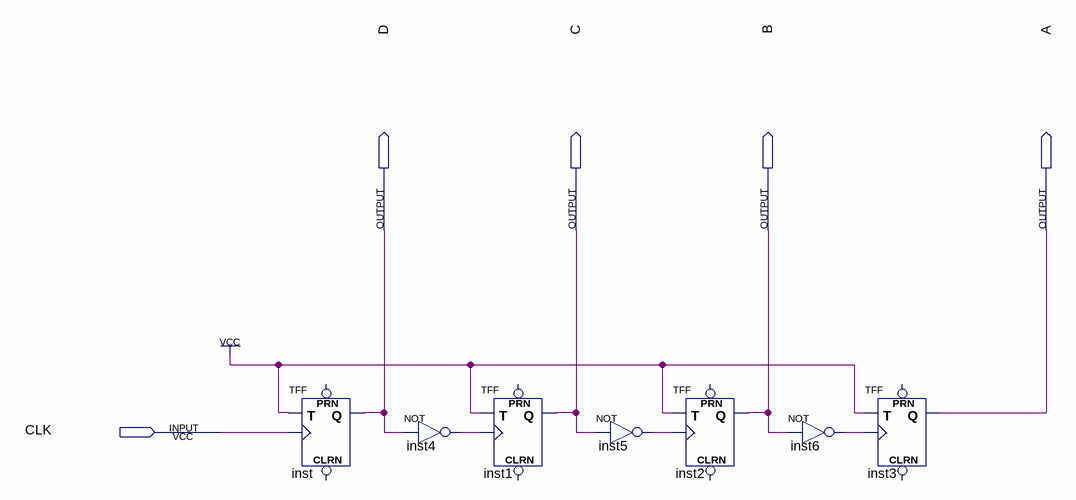
[diagram p0: schematic sheet]
// Quartus schematic LAB5_BaiTapVeNha.bdf as structural Verilog: 7 symbols, 5 pins
module LAB5_BaiTapVeNha (
  input  CLK,
  output D,
  output C,
  output B,
  output A
);

  wire inst4_out, inst5_out, inst6_out;

  TFF inst (.T(1'b1), .CLK(CLK), .Q(D));  // open: PRN, CLRN
  not inst4 (inst4_out, D);
  TFF inst1 (.T(1'b1), .CLK(inst4_out), .Q(C));  // open: PRN, CLRN
  not inst5 (inst5_out, C);
  TFF inst2 (.T(1'b1), .CLK(inst5_out), .Q(B));  // open: PRN, CLRN
  not inst6 (inst6_out, B);
  TFF inst3 (.T(1'b1), .CLK(inst6_out), .Q(A));  // open: PRN, CLRN
endmodule
